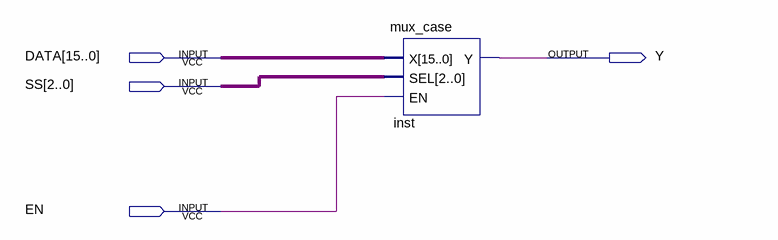
[diagram p0: schematic sheet]
// Quartus schematic behavioural.bdf as structural Verilog: 1 symbols, 4 pins
module behavioural (
  input  [15:0] DATA,
  input  [2:0] SS,
  input  EN,
  output Y
);

  mux_case inst (.X(DATA), .SEL(SS), .EN(EN), .Y(Y));
endmodule
